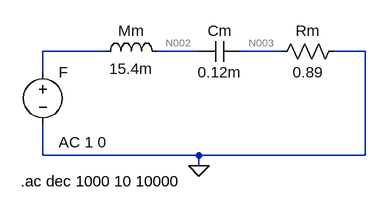
[diagram p0: schematic ex1_massamola_direto.asc]
ex1_massamola_direto.asc, the LTspice schematic file:
Version 4
SHEET 1 880 680
WIRE 32 80 -64 80
WIRE 176 80 112 80
WIRE 304 80 240 80
WIRE 432 80 384 80
WIRE -64 112 -64 80
WIRE -64 240 -64 192
WIRE 176 240 -64 240
WIRE 432 240 432 80
WIRE 432 240 176 240
WIRE 176 256 176 240
FLAG 176 256 0
SYMBOL voltage -64 96 R0
WINDOW 123 24 124 Left 2
WINDOW 39 0 0 Left 0
SYMATTR Value2 AC 1 0
SYMATTR InstName F
SYMATTR Value ""
SYMBOL ind 16 96 R270
WINDOW 0 32 56 VTop 2
WINDOW 3 5 56 VBottom 2
SYMATTR InstName Mm
SYMATTR Value 15.4m
SYMBOL cap 240 64 R90
WINDOW 0 0 32 VBottom 2
WINDOW 3 32 32 VTop 2
SYMATTR InstName Cm
SYMATTR Value 0.12m
SYMBOL res 400 64 R90
WINDOW 0 0 56 VBottom 2
WINDOW 3 32 56 VTop 2
SYMATTR InstName Rm
SYMATTR Value 0.89
TEXT -98 280 Left 2 !.ac dec 1000 10 10000

The netlist it stands for:
* ex1_massamola_direto.asc
V§F N001 0 AC 1 0
L§Mm N001 N002 15.4m
Cm N003 N002 0.12m
Rm 0 N003 0.89
.ac dec 1000 10 10000
.backanno
.end

* Results of the author's LTspice run, read from the files saved beside the schematic
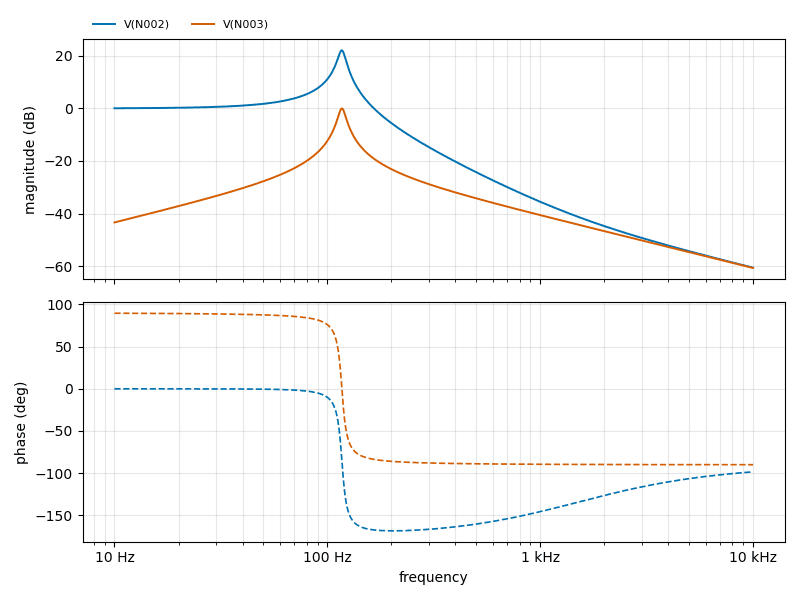
[diagram p1: AC Analysis of ex1_massamola_direto.asc, plotted from the saved traces]
* AC Analysis, 1 run:
*   V(N002): 0.06 dB at 10 Hz, -60.63 dB at 10 kHz, peak 22.12 dB at 116.9 Hz, 3 dB below the peak at 112.2 Hz and 121.4 Hz
*   V(N003): -43.40 dB at 10 Hz, -60.73 dB at 10 kHz, peak -0.01 dB at 116.9 Hz, 3 dB below the peak at 112.6 Hz and 121.8 Hz